# EAGLE schematic ESP8266_1wire_Gateway (EAGLE 7.5.0)
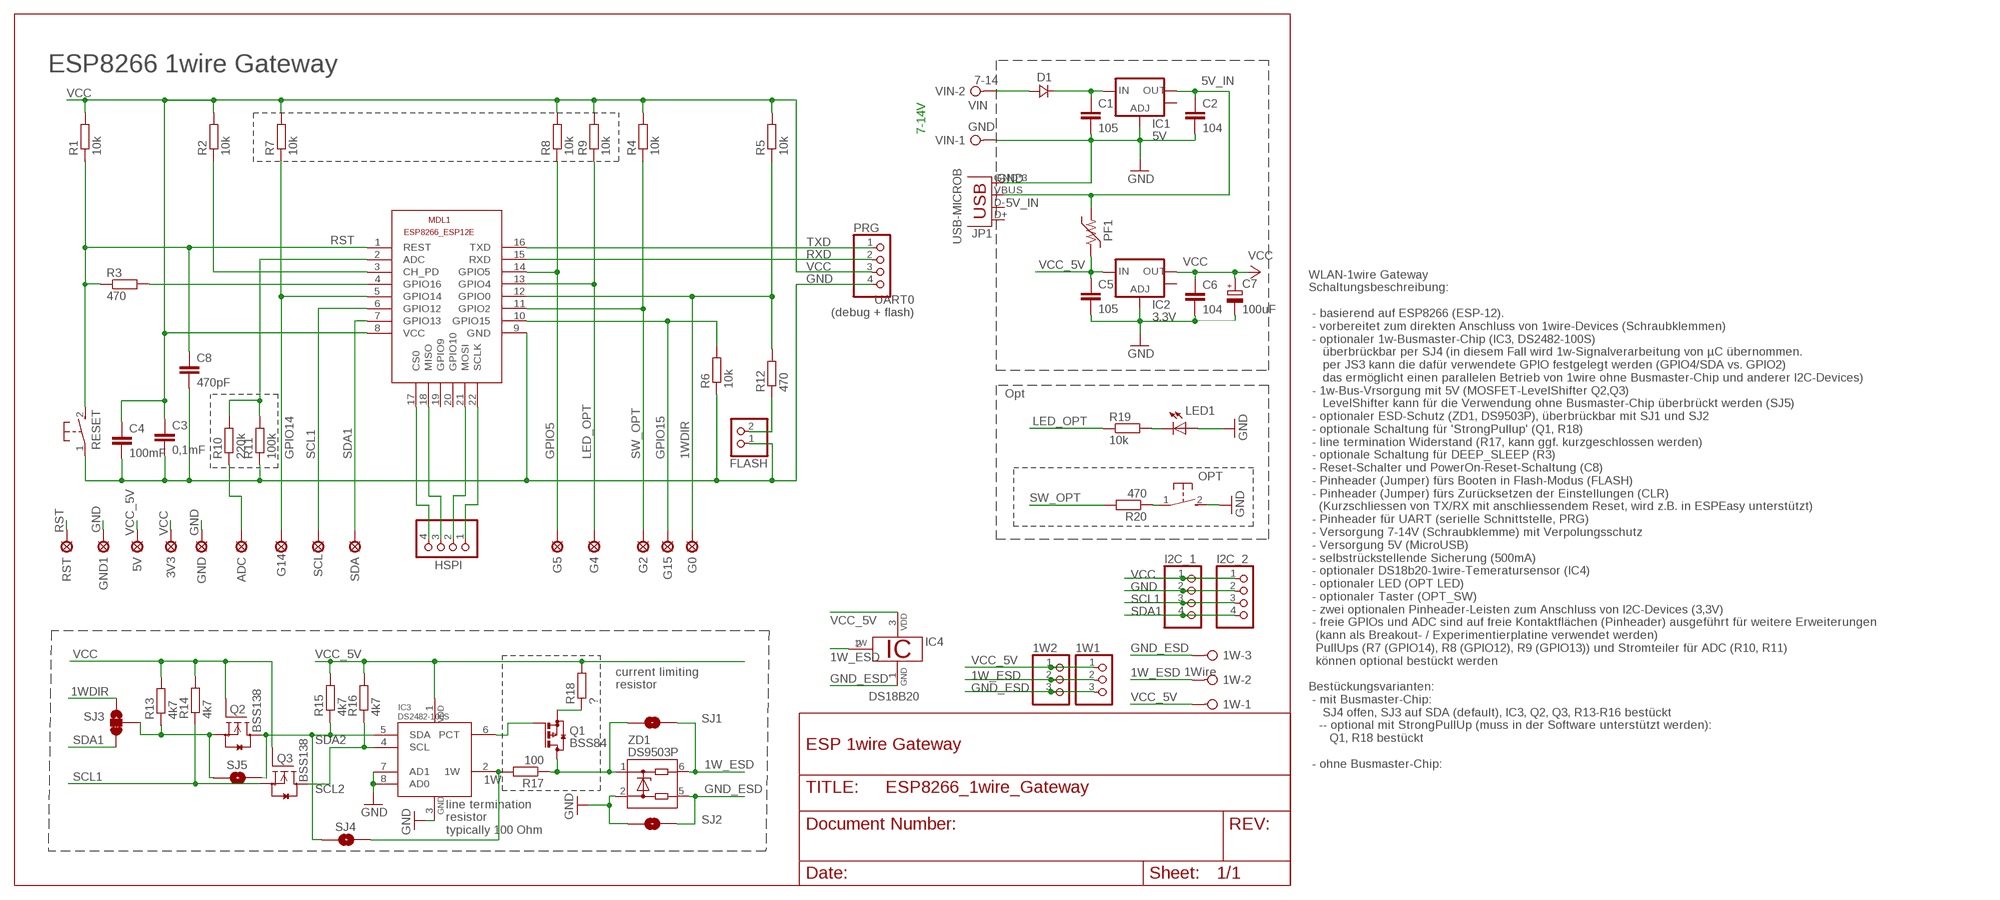
[diagram p0: schematic, sheet 1]

## Parts
1W  1Wire  W237-03P  [W237-133]
1W1  PINHD-1X3_S  [1X03]
1W2  PINHD-1X3_S  [1X03]
3V3  LSP10  [LSP10]
5V  LSP10  [LSP10]
ADC  LSP10  [LSP10]
C1  105  C-EUC0805  [C0805]
C2  104  C-EUC0805  [C0805]
C3  0,1mF  C-EUC0805  [C0805]
C4  100mF  C-EUC1210  [C1210]
C5  105  C-EUC0805  [C0805]
C6  104  C-EUC0805  [C0805]
C7  100uF  CPOL-EUE2,5-6E  [E2,5-6E]
C8  470pF  C-EUC0805  [C0805]
D1  SS14  [DO214]
FLASH  PINHD-1X2_S  [1X02]
G0  LSP10  [LSP10]
G2  LSP10  [LSP10]
G4  LSP10  [LSP10]
G5  LSP10  [LSP10]
G14  LSP10  [LSP10]
G15  LSP10  [LSP10]
GND  LSP10  [LSP10]
GND1  GND  LSP10  [LSP10]
HSPI  PINHD-1X4_S  [1X04]
I2C_1  PINHD-1X4_S  [1X04]
I2C_2  PINHD-1X4_S  [1X04]
IC1  5V  V_REG_LM1117SOT223  [SOT223]
IC2  3.3V  V_REG_LM1117SOT223  [SOT223]
IC3  DS2482-100S  [SO08]
IC4  DS18B20  [TO92-]
JP1  USB-MICROB  [USB-MICROB]
LED1  CFG  LEDCHIPLED_1206  [CHIPLED_1206]
MDL1  µC  ESP8266-12EESP8266-ESP12E  [ESP8266-ESP12E]
OPT  DTSM-3  [DTSM-3]
PF1  500mA  PTC-F1206  [F1206]
PRG  PINHD-1X4_S  [1X04]
Q1  BSS84  [SOT23]
Q2  BSS138  [SOT23]
Q3  BSS138  [SOT23]
R1  10k  R-EU_R0805  [R0805]
R2  10k  R-EU_R0805  [R0805]
R3  470  R-EU_R0805  [R0805]
R4  10k  R-EU_R0805  [R0805]
R5  10k  R-EU_R0805  [R0805]
R6  10k  R-EU_R0805  [R0805]
R7  10k  R-EU_R0805  [R0805]
R8  10k  R-EU_R0805  [R0805]
R9  10k  R-EU_R0805  [R0805]
R10  220k  R-EU_R0805  [R0805]
R11  100k  R-EU_R0805  [R0805]
R12  470  R-EU_R0805  [R0805]
R13  4k7  R-EU_R0805  [R0805]
R14  4k7  R-EU_R0805  [R0805]
R15  4k7  R-EU_R0805  [R0805]
R16  4k7  R-EU_R0805  [R0805]
R17  100  R0805_SMALL_GAP  [R0805_SMALL_GAP]
R18  ?  R0805_SMALL_GAP  [R0805_SMALL_GAP]
R19  10k  R-EU_R0805  [R0805]
R20  470  R-EU_R0805  [R0805]
RESET  DTSM-3  [DTSM-3]
RST  RST  LSP10  [LSP10]
SCL  LSP10  [LSP10]
SDA  LSP10  [LSP10]
SJ1  JUMPER-PAD-2-NOYES_SILK  [PAD-JUMPER-2-NO_YES_SILK]
SJ2  JUMPER-PAD-2-NOYES_SILK  [PAD-JUMPER-2-NO_YES_SILK]
SJ3  JUMPER-PAD-3-2OF3_NC_BY_TRACE_SMALL  [PAD-JUMPER-3-2OF3_NC_BY_TRACE_YES_SILK_FULL_BOX]
SJ4  JUMPER-PAD-2-NOYES_SILK  [PAD-JUMPER-2-NO_YES_SILK]
SJ5  JUMPER-PAD-2-NOYES_SILK  [PAD-JUMPER-2-NO_YES_SILK]
VIN  7-14  W237-02P  [W237-132]
ZD1  DS9503P  [TSOC6]

## Nets
1W: IC3.2(1W) R17.2 SJ4.1
1W_: Q1.3(D) R17.1 SJ1.1 ZD1.1
1W_ESD: 1W1.2 1W2.2 1W.2 IC4.2(1W) SJ1.2 ZD1.6
1WDIR: G0.1(MP) MDL1.12(GPIO0) R5.1 R12.2 SJ3.1
5V_IN: C2.1 IC1.2(OUT) JP1.VBUS PF1.2
ADC: MDL1.2(ADC) R10.2 R11.2
CH_PD: MDL1.3(CH_PD) R2.1
DEEP_SLEEP: MDL1.4(GPIO16) R3.2
GND: C1.2 C2.2 C3.2 C4.2 C5.2 C6.2 C7.- C8.2 FLASH.1 GND1.1(MP) GND.1(MP) I2C_1.2 I2C_2.2 IC1.1(ADJ) IC2.1(ADJ) IC3.3(GND) IC3.7(AD1) IC3.8(AD0) JP1.GND JP1.MT1(GND) JP1.MT2(GND) LED1.A MDL1.9(GND) OPT.2 PRG.4 R6.1 R11.1 RESET.1 SJ2.1 VIN.1 ZD1.2
GND_ESD: 1W1.3 1W2.3 1W.3 IC4.1(GND) SJ2.2 ZD1.5
GPIO5: G5.1(MP) MDL1.14(GPIO5) R8.1
GPIO14: G14.1(MP) MDL1.5(GPIO14) R7.1
GPIO15: G15.1(MP) MDL1.10(GPIO15) R6.2
HCS0: HSPI.4 MDL1.17(CS0)
HMISO: HSPI.3 MDL1.18(MISO)
HMOSI: HSPI.2 MDL1.21(MOSI)
HSCLK: HSPI.1 MDL1.22(SCLK)
LED_OPT: G4.1(MP) MDL1.13(GPIO4) R9.1 R19.1
N$4: LED1.C R19.2
N$5: ADC.1(MP) R10.1
N$6: IC3.6(PCT) Q1.1(G)
N$7: Q1.2(S) R18.1
N$8: C1.1 D1.CATHODE IC1.3(IN)
N$10: FLASH.2 R12.1
N$11: OPT.1 R20.1
RST: C8.1 MDL1.1(REST) R1.1 R3.1 RESET.2 RST.1(MP)
RXD: MDL1.15(RXD) PRG.2
SCL1: I2C_1.3 I2C_2.3 MDL1.6(GPIO12) Q3.2(S) R14.1 SCL.1(MP)
SCL2: IC3.4(SCL) Q3.3(D) R16.1
SDA1: I2C_1.4 I2C_2.4 MDL1.7(GPIO13) SDA.1(MP) SJ3.3
SDA1X: Q2.2(S) R13.1 SJ3.2 SJ5.2
SDA2: IC3.5(SDA) Q2.3(D) R15.1 SJ4.2 SJ5.1
SW_OPT: G2.1(MP) MDL1.11(GPIO2) R4.1 R20.2
TXD: MDL1.16(TXD) PRG.1
VCC: 3V3.1(MP) C3.1 C4.1 C6.1 C7.+ I2C_1.1 I2C_2.1 IC2.2(OUT) MDL1.8(VCC) PRG.3 Q2.1(G) Q3.1(G) R1.2 R2.2 R4.2 R5.2 R7.2 R8.2 R9.2 R13.2 R14.2
VCC_5V: 1W1.1 1W2.1 1W.1 5V.1(MP) C5.1 IC2.3(IN) IC3.1(VDD) IC4.3(VDD) PF1.1 R15.2 R16.2 R18.2
VIN: D1.ANODE VIN.2
Unconnected: IC1.4(OUT) IC2.4(OUT) JP1.D+ JP1.D- MDL1.19(GPIO9) MDL1.20(GPIO10)

## Notes on the sheet
- ESP8266 1wire Gateway
- 7-14V
- UART0
  (debug + flash)
- Opt
- current limiting 
  resistor
- ESP 1wire Gateway
- WLAN-1wire Gateway
  Schaltungsbeschreibung:
  
   - basierend auf ESP8266 (ESP-12).
   - vorbereitet zum direkten Anschluss von 1wire-Devices (Schraubklemmen)
   - optionaler 1w-Busmaster-Chip (IC3, DS2482-100S)
      überbrückbar per SJ4 (in diesem Fall wird 1w-Signalverarbeitung von µC übernommen.
      per JS3 kann die dafür verwendete GPIO festgelegt werden (GPIO4/SDA vs. GPIO2)
      das ermöglicht einen parallelen Betrieb von 1wire ohne Busmaster-Chip und anderer I2C-Devices)
   - 1w-Bus-Vrsorgung mit 5V (MOSFET-LevelShifter Q2,Q3)
      LevelShifter kann für die Verwendung ohne Busmaster-Chip überbrückt werden (SJ5)
   - optionaler ESD-Schutz (ZD1, DS9503P), überbrückbar mit SJ1 und SJ2
   - optionale Schaltung für 'StrongPullup' (Q1, R18)
   - line termination Widerstand (R17, kann ggf. kurzgeschlossen werden)
   - optionale Schaltung für DEEP_SLEEP (R3)
   - Reset-Schalter und PowerOn-Reset-Schaltung (C8)
   - Pinheader (Jumper) fürs Booten in Flash-Modus (FLASH)
   - Pinheader (Jumper) fürs Zurücksetzen der Einstellungen (CLR)
     (Kurzschliessen von TX/RX mit anschliessendem Reset, wird z.B. in ESPEasy unterstützt)
   - Pinheader für UART (serielle Schnittstelle, PRG)
   - Versorgung 7-14V (Schraubklemme) mit Verpolungsschutz 
   - Versorgung 5V (MicroUSB)
   - selbstrückstellende Sicherung (500mA)
   - optionaler DS18b20-1wire-Temeratursensor (IC4)
   - optionaler LED (OPT LED)
   - optionaler Taster (OPT_SW)
   - zwei optionalen Pinheader-Leisten zum Anschluss von I2C-Devices (3,3V)
   - freie GPIOs und ADC sind auf freie Kontaktflächen (Pinheader) ausgeführt für weitere Erweiterungen
    (kann als Breakout- / Experimentierplatine verwendet werden)
    PullUps (R7 (GPIO14), R8 (GPIO12), R9 (GPIO13)) und Stromteiler für ADC (R10, R11) 
    können optional bestückt werden
  
  Bestückungsvarianten:
   - mit Busmaster-Chip: 
      SJ4 offen, SJ3 auf SDA (default), IC3, Q2, Q3, R13-R16 bestückt
     -- optional mit StrongPullUp (muss in der Software unterstützt werden):
        Q1, R18 bestückt
      
   - ohne Busmaster-Chip: 
      SJ geschlossen, SJ3 auf GPIO2, 
       -- mit LevelShifter (5V 1wire):
        SJ5 offen,Q2, R13, R15 bestückt (Q3, R14,R16 ohne Bedeutung)
       -- ohne LevelShifter (3,3V qwire):
        SJ5 geschlossen (Q2, Q3 unbestückt, R14-R16 ohne Bedeutung)
  
   - mit ESD-Protection:
     SJ1, SJ2 offen, ZD1 bestückt
  
   - ohne ESD-Protection
     SJ1, SJ2 geschlossen, ZD1 unbestückt
  
   - bei der Benutzung von I2C: R13 und R14 sind immer zu bestücken.
  
  Flashen:
    Jumper FLASH kurzschliessen und Reset betätigen,
    danach FLASH Jumper wieder öffnen
  
  Clear (muss in der Software unterstützt werden):
    Jumper CLR kurzschliessen und Reset-Knopf drücken
- line termination 
  resistor 
  typically 100 Ohm

## Library data of the parts
1W = my:W237-03P: WAGO SREW CLAMP; OC_FARNELL: unknown; OC_NEWARK: unknown
1W1 1W2 = my:PINHD-1X3_S: PIN HEADER
3V3 5V ADC G0 G2 G4 G5 G14 G15 GND GND1 RST SCL SDA = my:LSP10: SOLDER PAD drill 1.0 mm, distributor Buerklin, 12H555
C1-C6 C8 = resistor:C-EU: CAPACITOR, European symbol
C7 = rcl:CPOL-EU: POLARIZED CAPACITOR, European symbol
D1 = ihpcb-diode:SS14
FLASH = my:PINHD-1X2_S: PIN HEADER
HSPI I2C_1 I2C_2 PRG = my:PINHD-1X4_S: PIN HEADER
IC1 IC2 = SparkFun-PowerIC:V_REG_LM1117: Voltage Regulator LM1117 Standard adjustable voltage regulator but in SMD form. Spark Fun Electronics SKU : COM-00595; PROD_ID: VREG-08170
IC3 = my:DS2482-100: I2C to 1-Wire Host Adapter/Line Driver This device is a onewire host and I2C interface in one chip. It provides the complete DC/AC requirements for onewire communication, including overdrive speed mode, but, unlike the DS2480B chip, no 12V EPROM programming. Notes: For overdrive speed and 5V EEPROM programming, an external active pullup circuit must be connected to the 1W, VDD and PCT pin. See the datasheet for details. The lower two I2C adress bits of the chip can be selected by external pins, so up to 4 chips may be connected to the same I2C bus. Author: Orginal device and description from Giovanni Varasano <giovanni.varasano@fastwebnet.it> Improved by Jan Kandziora <jjj@gmx.de>
IC4 = my:DS18B20: Programmable Resolution Digital Thermometer This chip provides a onewire thermosensor with approx. 0.5°C accuracy. A programmable over/undertemperure alarm is available. The precision can be set from 9..12 bits. Notes: Vdd must be applied for accurate measurements at low temperatures, as the parasite power circuit otherwise heats the sensor. If parasite power is used, Vdd has to be connected to GND. The DS1822 is a low-cost thermometer chip, the DS18S20 is similar to the DS18B20, but with 9 Bit precision only. Author: Jan Kandziora <jjj@gmx.de>
JP1 = SparkFun-Connectors:USB: USB Connectors USB-B-PTH is fully proven SKU : PRT-00139/CONN-08278 USB-miniB is fully proven SKU : PRT-00587 USB-A-PCB is untested. USB-A-H is throughly reviewed, but untested. Spark Fun Electronics SKU : PRT-00437 USB-B-SMT is throughly reviewed, but untested. Needs silkscreen touching up. USB-A-S has not been used/tested USB-MB-H has not been used/tested USB-MICROB has been used. CONN-09505; PROD_ID: CONN-09505
LED1 = led:LED: LED OSRAM: - CHIPLED LG R971, LG N971, LY N971, LG Q971, LY Q971, LO R971, LY R971 LH N974, LH R974 LS Q976, LO Q976, LY Q976 LO Q996 - Hyper CHIPLED LW Q18S LB Q993, LB Q99A, LB R99A - SideLED LS A670, LO A670, LY A670, LG A670, LP A670 LB A673, LV A673, LT A673, LW A673 LH A674 LY A675 LS A676, LA A676, LO A676, LY A676, LW A676 LS A679, LY A679, LG A679 - Hyper Micro SIDELED® LS Y876, LA Y876, LO Y876, LY Y876 LT Y87S - SmartLED LW L88C, LW L88S LB L89C, LB L89S, LG L890 LS L89K, LO L89K, LY L89K LS L896, LA L896, LO L896, LY L896 - TOPLED LS T670, LO T670, LY T670, LG T670, LP T670 LSG T670, LSP T670, LSY T670, LOP T670, LYG T670 LG T671, LOG T671, LSG T671 LB T673, LV T673, LT T673, LW T673 LH T674 LS T676, LA T676, LO T676, LY T676, LB T676, LH T676, LSB T676, LW T676 LB T67C, LV T67C, LT T67C, LS T67K, LO T67K, LY T67K, LW E67C LS E67B, LA E67B, LO E67B, LY E67B, LB E67C, LV E67C, LT E67C LW T67C LS T679, LY T679, LG T679 LS T770, LO T770, LY T770, LG T770, LP T770 LB T773, LV T773, LT T773, LW T773 LH T774 LS E675, LA E675, LY E675, LS T675 LS T776, LA T776, LO T776, LY T776, LB T776 LHGB T686 LT T68C, LB T68C - Hyper Mini TOPLED® LB M676 - Mini TOPLED Santana® LG M470 LS M47K, LO M47K, LY M47K Source: http://www.osram.convergy.de LUXEON: - LUMILED® LXK2-PW12-R00, LXK2-PW12-S00, LXK2-PW14-U00, LXK2-PW14-V00 LXK2-PM12-R00, LXK2-PM12-S00, LXK2-PM14-U00 LXK2-PE12-Q00, LXK2-PE12-R00, LXK2-PE12-S00, LXK2-PE14-T00, LXK2-PE14-U00 LXK2-PB12-K00, LXK2-PB12-L00, LXK2-PB12-M00, LXK2-PB14-N00, LXK2-PB14-P00, LXK2-PB14-Q00 LXK2-PR12-L00, LXK2-PR12-M00, LXK2-PR14-Q00, LXK2-PR14-R00 LXK2-PD12-Q00, LXK2-PD12-R00, LXK2-PD12-S00 LXK2-PH12-R00, LXK2-PH12-S00 LXK2-PL12-P00, LXK2-PL12-Q00, LXK2-PL12-R00 Source: www.luxeon.com KINGBRIGHT: KA-3528ASYC Source: www.kingbright.com
MDL1 = ESP8266-ESP12E:ESP8266-12E: ESP8266-12E with additional I/O and GPIO04/05 corrected The author cannot warrant that this library is free from error or will meet your specific requirements. Created by PuceBaboon.com. Komagane, Nagano, JAPAN
OPT RESET = mechanics:DTSM-3: Diptronics SMD button 6x3.5 mm
PF1 = polyswitch:PTC-: POLYSWITCH Polyswitch Resetable Fuses
Q1 = transistor-small-signal:BSS84: P-CHANNEL MOS FET
Q2 Q3 = my:BSS138: Fairchild Semiconductors BSS138 N-Channel Logic Level Enhancement Mode Field Effect Transistor General Description: These N-Channel enhancement mode field effect transistors are produced using Fairchild's proprietary, high cell density, DMOS technology. These products have been designed to minimize on-state resistance while provide rugged, reliable, and fast switching performance.These products are particularly suited for low voltage, low current applications such as small servo motor control, power MOSFET gate drivers, and other switching applications. Features: 0.22 A, 50 V. RDS(ON) = 3.5Ohm @ VGS = 10 V RDS(ON) = 6.0Ohm @ VGS = 4.5 V High density cell design for extremely low RDS(ON) Rugged and Reliable Compact industry standard SOT-23 surface mount package Please send any comments to: messi@users.sourceforge.net
R1-R16 R20 = resistor:R-EU_: RESISTOR, European symbol
R17 R18 = my:R0805_SMALL_GAP: SMD Resistor (0805) mit einer schmalleren Lücke (kann als Lötjumper erwendet werden)
R19 = rcl:R-EU_: RESISTOR, European symbol
SJ1 SJ2 SJ4 SJ5 = SparkFun-Passives:JUMPER-PAD-2-NO
SJ3 = SparkFun-Passives:JUMPER-PAD-3-2OF3_NC_BY_TRACE
VIN = my:W237-02P: WAGO SREW CLAMP; OC_FARNELL: unknown; OC_NEWARK: unknown
ZD1 = 1wire:DS9503: ESD Protection Diode with Resistors This ESD protection diode is designed especially for onewire host interfaces. Unlike the DS9502, it has two additional 5Ohm resitors in the 1W and GND line. Pin 5 and 6 have to be connected to the host side, pin 1 und 2 to the network side. The 1W line is through pin 1 and 6, the GND line is through pin 2 and 5. Author: Jan Kandziora <jjj@gmx.de>